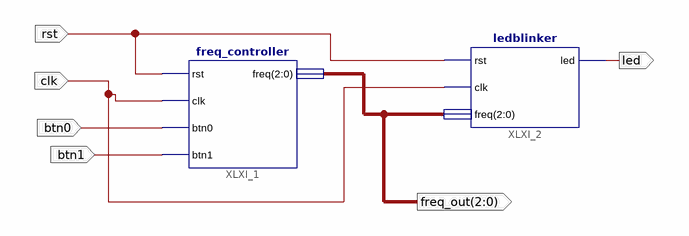
[diagram p0: schematic sheet 1]
// Xilinx ISE schematic whole_design.sch (spartan6) as structural Verilog: 2 symbols, 6 ports
module whole_design (
  input  btn0,
  input  btn1,
  input  rst,
  input  clk,
  output [2:0] freq_out,
  output led
);

  freq_controller XLXI_1 (.rst(rst), .clk(clk), .btn0(btn0), .btn1(btn1), .freq(freq_out));
  ledblinker XLXI_2 (.rst(rst), .clk(clk), .freq(freq_out), .led(led));
endmodule
